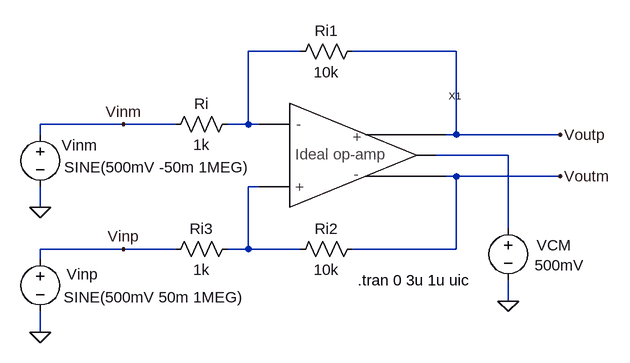
[diagram p0: schematic Ideal_diff_op_amp_x10.asc]
Ideal_diff_op_amp_x10.asc, the LTspice schematic file:
Version 4
SHEET 1 2760 680
WIRE 512 -160 512 -176
WIRE 512 -48 512 -80
WIRE 512 32 512 16
WIRE 512 144 512 112
WIRE 640 -176 512 -176
WIRE 640 16 512 16
WIRE 720 -176 640 -176
WIRE 720 16 640 16
WIRE 832 -176 800 -176
WIRE 832 -176 832 -288
WIRE 832 16 800 16
WIRE 832 16 832 -80
WIRE 848 -176 832 -176
WIRE 848 -80 832 -80
WIRE 912 -288 832 -288
WIRE 912 16 832 16
WIRE 1152 -288 992 -288
WIRE 1152 -160 1136 -160
WIRE 1152 -160 1152 -288
WIRE 1152 -96 1136 -96
WIRE 1152 16 992 16
WIRE 1152 16 1152 -96
WIRE 1232 -128 1120 -128
WIRE 1232 -16 1232 -128
WIRE 1232 96 1232 64
WIRE 1312 -160 1152 -160
WIRE 1312 -96 1152 -96
FLAG 1312 -160 Voutp
FLAG 512 -48 0
FLAG 640 -176 Vinm
FLAG 1312 -96 Voutm
FLAG 512 144 0
FLAG 640 16 Vinp
FLAG 1232 96 0
SYMBOL res 704 -160 R270
WINDOW 0 32 56 VTop 0
WINDOW 3 0 56 VBottom 0
SYMATTR InstName Ri
SYMATTR Value 1k
SYMBOL res 896 -272 R270
WINDOW 0 32 56 VTop 0
WINDOW 3 0 56 VBottom 0
SYMATTR InstName Ri1
SYMATTR Value 10k
SYMBOL voltage 512 -176 R0
WINDOW 0 33 32 Left 0
WINDOW 3 37 66 Left 0
WINDOW 123 0 0 Left 0
WINDOW 39 0 0 Left 0
SYMATTR InstName Vinm
SYMATTR Value SINE(500mV -50m 1MEG)
SYMBOL Ideal_differential_op_amp 896 -128 R0
SYMATTR InstName X1
SYMBOL res 896 32 R270
WINDOW 0 32 56 VTop 0
WINDOW 3 0 56 VBottom 0
SYMATTR InstName Ri2
SYMATTR Value 10k
SYMBOL res 704 32 R270
WINDOW 0 32 56 VTop 0
WINDOW 3 0 56 VBottom 0
SYMATTR InstName Ri3
SYMATTR Value 1k
SYMBOL voltage 512 16 R0
WINDOW 0 41 39 Left 0
WINDOW 3 36 74 Left 0
WINDOW 123 0 0 Left 0
WINDOW 39 0 0 Left 0
SYMATTR InstName Vinp
SYMATTR Value SINE(500mV 50m 1MEG)
SYMBOL voltage 1232 -32 R0
WINDOW 0 44 42 Left 0
WINDOW 3 41 73 Left 0
SYMATTR InstName VCM
SYMATTR Value 500mV
TEXT 1000 64 Left 0 !.tran 0 3u 1u uic

The netlist it stands for:
* Ideal_diff_op_amp_x10.asc
Ri Vinm N001 1k
Ri1 N001 Voutp 10k
Vinm Vinm 0 SINE(500mV -50m 1MEG)
XX1 N001 N002 Voutp N003 Voutm Ideal_differential_op_amp  ; pins Vinm Vinp Outp VCM Outm
Ri2 N002 Voutm 10k
Ri3 Vinp N002 1k
Vinp Vinp 0 SINE(500mV 50m 1MEG)
VCM N003 0 500mV
.tran 0 3u 1u uic
.backanno
.end